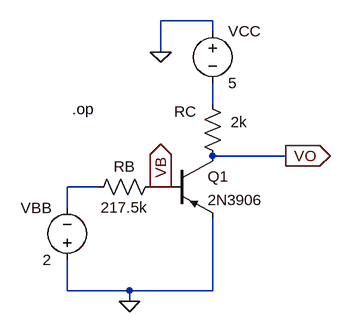
[diagram p0: schematic fig6_14a_2DC-voltage_sources.asc]
fig6_14a_2DC-voltage_sources.asc, the LTspice schematic file:
Version 4
SHEET 1 880 680
WIRE 256 -96 176 -96
WIRE 256 -80 256 -96
WIRE 176 -48 176 -96
WIRE 256 32 256 0
WIRE 368 112 256 112
WIRE 80 160 32 160
WIRE 176 160 160 160
WIRE 192 160 176 160
WIRE 32 192 32 160
WIRE 32 320 32 272
WIRE 128 320 32 320
WIRE 256 320 256 208
WIRE 256 320 128 320
WIRE 128 336 128 320
FLAG 128 336 0
FLAG 176 -48 0
FLAG 368 112 VO
IOPIN 368 112 Out
FLAG 176 160 VB
IOPIN 176 160 Out
SYMBOL pnp 192 112 R0
SYMATTR InstName Q1
SYMATTR Value 2N3906
SYMBOL res 240 16 R0
WINDOW 0 -43 28 Left 2
WINDOW 3 44 44 Left 2
SYMATTR InstName RC
SYMATTR Value 2k
SYMBOL res 176 144 R90
WINDOW 0 0 56 VBottom 2
WINDOW 3 32 56 VTop 2
SYMATTR InstName RB
SYMATTR Value 217.5k
SYMBOL voltage 256 -96 R0
SYMATTR InstName VCC
SYMATTR Value 5
SYMBOL voltage 32 288 R180
WINDOW 0 24 96 Left 2
WINDOW 3 24 16 Left 2
SYMATTR InstName VBB
SYMATTR Value 2
TEXT 40 40 Left 2 !.op

The netlist it stands for:
* fig6_14a_2DC-voltage_sources.asc
Q1 VO VB 0 0 2N3906
RC N001 VO 2k
RB VB N002 217.5k
VCC 0 N001 5
VBB 0 N002 2
.model NPN NPN
.model PNP PNP
.lib standard.bjt
.op
.backanno
.end